# EAGLE design Lipo-Charger-5V-setup (EAGLE 8.2.0)
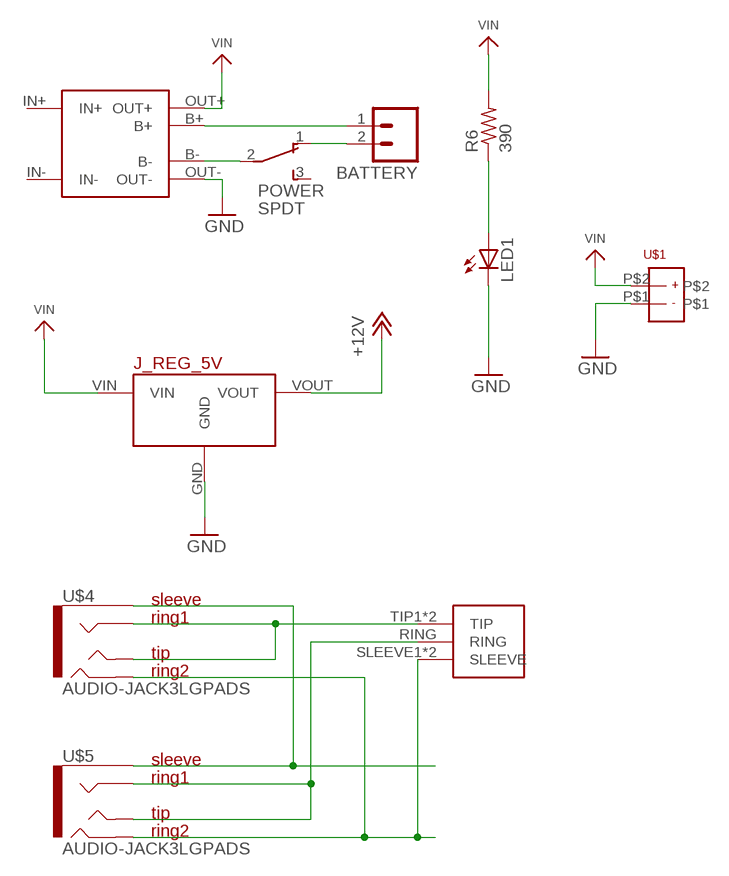
[diagram p0: schematic, sheet 1]

## Parts
AUDIO_OUT  1/8"-F-STEREO-PCB  [1/8"-F-STEREO-PCB]
BATTERY  M02LOCK  [1X02_LOCK]
J_REG_5V  POLOLU_VOLTAGE_REGULATORS_3PIN  [POLOLU_5V-12V_STEPUP_U3V12F5-U3V12F12]
LED1  LED3MM  [LED3MM]
POWER  SPDT  SWITCH_SPDTTE-CONNECT  [SWITCH_SPDT-TE-CONNECT]
R6  390  R-US_0204/7  [0204/7]
U$1  BATTERY-3.7V-1S-LIPOBATTERY_MORPILOT-3.7-1S-720MAH  [BATTERY_MORPILOT-3.7-1S-720MAH]
U$4  AUDIO-JACK3LGPADS  [AUDIO-JACK-TRRS-SMD]
U$5  AUDIO-JACK3LGPADS  [AUDIO-JACK-TRRS-SMD]
USB-LIPO-CHARGER  TP4056-MODULE  [TP4056-LITHIUM-PROTECTED-MODULE]

## Nets
+5V: U$4.EARTH U$5.EARTH
+12V: J_REG_5V.VOUT
GND: J_REG_5V.GND LED1.K(C) U$1.P$1 USB-LIPO-CHARGER.OUT-
GND1: AUDIO_OUT.SLEEVE1(SLEEVE) AUDIO_OUT.SLEEVE2(SLEEVE) U$4.RING2 U$5.RING2
N$1: BATTERY.2 POWER.1
N$2: LED1.A R6.1
N$8: AUDIO_OUT.RING U$5.RING1 U$5.TIP
N$18: BATTERY.1 USB-LIPO-CHARGER.B+
N$19: POWER.2 USB-LIPO-CHARGER.B-
OUT2: AUDIO_OUT.TIP1(TIP) AUDIO_OUT.TIP2(TIP) U$4.RING1 U$4.TIP
VIN: J_REG_5V.VIN R6.2 U$1.P$2 USB-LIPO-CHARGER.OUT+
Unconnected: POWER.3

## Power pins joined to a net without a drawn wire
IN+: USB-LIPO-CHARGER.IN+
IN-: USB-LIPO-CHARGER.IN-

## Library data of the parts
AUDIO_OUT = CMU-ArtFab:1/8"-F-STEREO-PCB
BATTERY = CMU-ArtFab:M02: Header 2 Standard 2-pin 0.1" header. Use with straight break away headers (SKU : PRT-00116), right angle break away headers (PRT-00553), swiss pins (PRT-00743), machine pins (PRT-00117), and female headers (PRT-00115). Molex polarized connector foot print use with SKU : PRT-08233 with associated crimp pins and housings.
J_REG_5V = CMU-ArtFab:POLOLU_VOLTAGE_REGULATORS_3PIN: Polulu 5V Step-Up/Step-Down Voltage REgulator S7V7F5
LED1 = led:LED: LED OSRAM: - CHIPLED LG R971, LG N971, LY N971, LG Q971, LY Q971, LO R971, LY R971 LH N974, LH R974 LS Q976, LO Q976, LY Q976 LO Q996 - Hyper CHIPLED LW Q18S LB Q993, LB Q99A, LB R99A - SideLED LS A670, LO A670, LY A670, LG A670, LP A670 LB A673, LV A673, LT A673, LW A673 LH A674 LY A675 LS A676, LA A676, LO A676, LY A676, LW A676 LS A679, LY A679, LG A679 - Hyper Micro SIDELED® LS Y876, LA Y876, LO Y876, LY Y876 LT Y87S - SmartLED LW L88C, LW L88S LB L89C, LB L89S, LG L890 LS L89K, LO L89K, LY L89K LS L896, LA L896, LO L896, LY L896 - TOPLED LS T670, LO T670, LY T670, LG T670, LP T670 LSG T670, LSP T670, LSY T670, LOP T670, LYG T670 LG T671, LOG T671, LSG T671 LB T673, LV T673, LT T673, LW T673 LH T674 LS T676, LA T676, LO T676, LY T676, LB T676, LH T676, LSB T676, LW T676 LB T67C, LV T67C, LT T67C, LS T67K, LO T67K, LY T67K, LW E67C LS E67B, LA E67B, LO E67B, LY E67B, LB E67C, LV E67C, LT E67C LW T67C LS T679, LY T679, LG T679 LS T770, LO T770, LY T770, LG T770, LP T770 LB T773, LV T773, LT T773, LW T773 LH T774 LS E675, LA E675, LY E675, LS T675 LS T776, LA T776, LO T776, LY T776, LB T776 LHGB T686 LT T68C, LB T68C - Hyper Mini TOPLED® LB M676 - Mini TOPLED Santana® LG M470 LS M47K, LO M47K, LY M47K Source: http://www.osram.convergy.de LUXEON: - LUMILED® LXK2-PW12-R00, LXK2-PW12-S00, LXK2-PW14-U00, LXK2-PW14-V00 LXK2-PM12-R00, LXK2-PM12-S00, LXK2-PM14-U00 LXK2-PE12-Q00, LXK2-PE12-R00, LXK2-PE12-S00, LXK2-PE14-T00, LXK2-PE14-U00 LXK2-PB12-K00, LXK2-PB12-L00, LXK2-PB12-M00, LXK2-PB14-N00, LXK2-PB14-P00, LXK2-PB14-Q00 LXK2-PR12-L00, LXK2-PR12-M00, LXK2-PR14-Q00, LXK2-PR14-R00 LXK2-PD12-Q00, LXK2-PD12-R00, LXK2-PD12-S00 LXK2-PH12-R00, LXK2-PH12-S00 LXK2-PL12-P00, LXK2-PL12-Q00, LXK2-PL12-R00 Source: www.luxeon.com KINGBRIGHT: KA-3528ASYC Source: www.kingbright.com
POWER = CMU-ArtFab:SWITCH_SPDT
R6 = CMU-ArtFab:R-US_: RESISTOR, American symbol
U$1 = CMU-ArtFab:BATTERY-3.7V-1S-LIPO
U$4 U$5 = CMU-ArtFab:AUDIO-JACK3: Audio jack - 3.5mm TRRS variety - two rings.
USB-LIPO-CHARGER = CMU-ArtFab:TP4056-MODULE

## Board
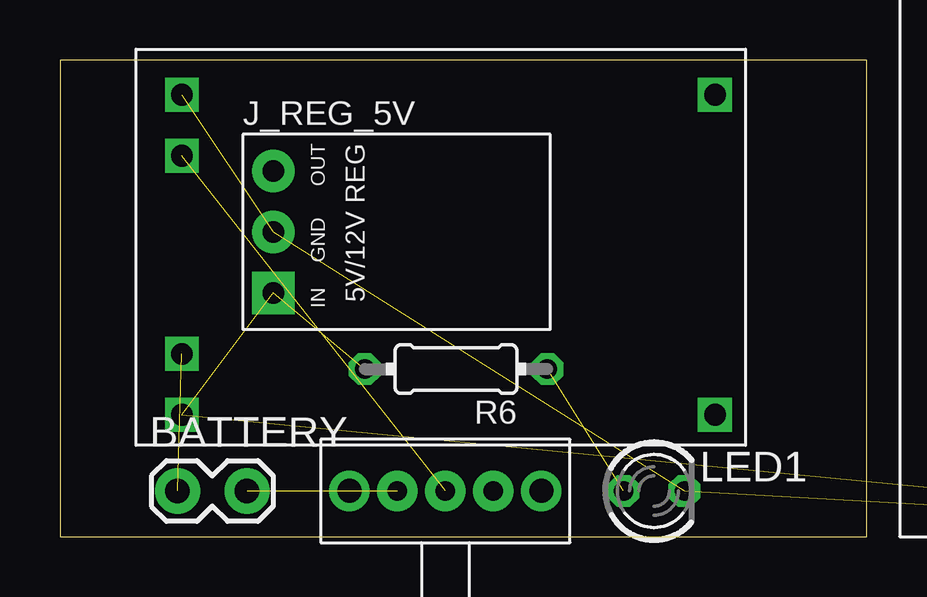
[diagram p1: board, top side]
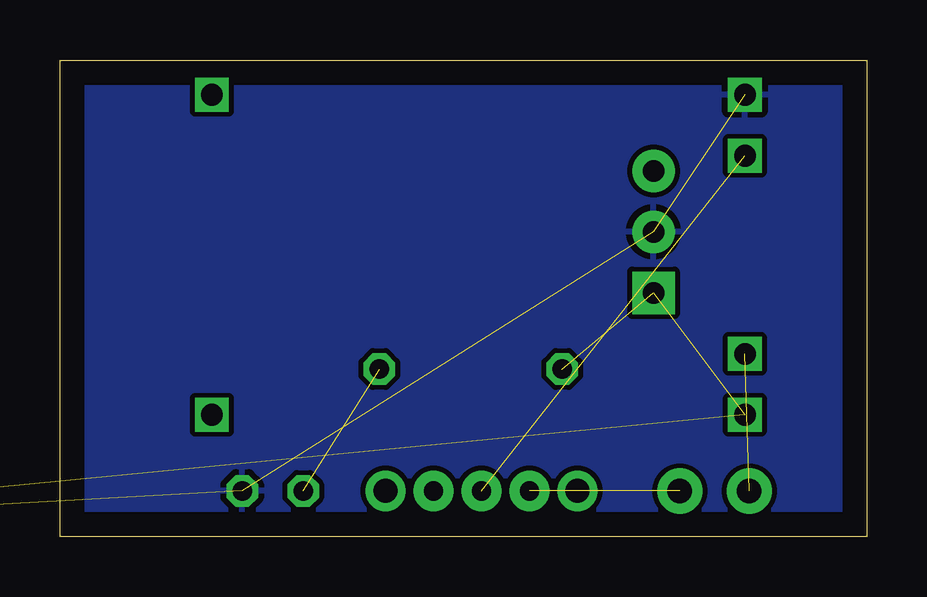
[diagram p2: board, bottom side, seen from below]

Size 33.63 x 19.86 mm. Coordinates in mm from the lower left corner, seen from the top.
Outline: 0,0 33.63,0 33.63,19.86 0,19.86 0,0
Copper layers (1*16): Top 0.035mm / dielectric 1.5mm / Bottom 0.035mm
Design rules "default": minimum track width 10mil, minimum drill 24mil, track to track 8mil, track to pad 8mil, pad to pad 8mil, via to via 8mil, smd to smd 8mil, copper to edge 40mil, drill to drill 8mil, minimum pad ring 10mil, minimum via ring 8mil, stop-mask expansion 4mil, vias tented up to drill 0mil, thermal gap 10mil

### Footprints (pad centres in the part's own frame; a part is rotated, then mirrored left to right if it is on the bottom)
1/8"-F-STEREO-PCB = drill 1.3: RING 5.461,0; SLEEVE1 8.636,6.934; SLEEVE2 8.636,0; TIP1 2.286,6.934; TIP2 2.286,0 | hole 1.4: 2.286,3.556; 7.874,3.556
1X02_LOCK = drill 1.016 pad 1.88: 1 -0.178,0; 2 2.718,0
POLOLU_5V-12V_STEPUP_U3V12F5-U3V12F12 = drill 0.9 pad 1.778: GND 0,-6.35; VOUT -2.54,-6.35 | drill 0.9 pad 1.778 square: VIN 2.54,-6.35
LED3MM = drill 0.813 octagon: A -1.27,0; K 1.27,0
SWITCH_SPDT-TE-CONNECT = drill 0.8 pad 1.676: 1 2,0; 2 4,0; 3 6,0 | drill 1 pad 1.676: MOUNT1 0,0; MOUNT2 8,0
0204/7 = drill 0.813 octagon: 1 -3.81,0; 2 3.81,0
BATTERY_MORPILOT-3.7-1S-720MAH = drill 0.6 square: P$1 0,0; P$2 0,2.54
AUDIO-JACK-TRRS-SMD = smd 1.524 x 3.175: EARTH 11.227,-3.619; RING1 6.2,3.619; RING2 3.2,3.619; TIP 10.2,3.619 | hole 1.2: 1.6,0; 8.6,0
TP4056-LITHIUM-PROTECTED-MODULE = drill 0.9 square: B+ 10.795,4.445; B- 10.795,-3.81; IN+ -11.43,6.985; IN- -11.43,-6.35; OUT+ 10.795,6.985; OUT- 10.795,-6.35

### Placement (x,y rotation side)
AUDIO_OUT  3,-25 0 top  (outside the outline)
BATTERY  5.08,1.91 0 top
J_REG_5V  15.24,12.7 270 top
LED1  24.77,1.91 0 top
POWER  12.06,1.91 0 top
R6  16.51,6.99 180 top
U$1  60,0 90 top  (outside the outline)
U$4  -2,-44 0 top  (outside the outline)
U$5  13,-44 0 top  (outside the outline)
USB-LIPO-CHARGER  15.88,12.06 180 top

### Tracks (layer width: path | path; a pad name or v marks a point on that pad's centre or on a via)
+5V  (1 unrouted)
GND  (3 unrouted)
  pour Bottom: 0,0 0,19.68 33.66,19.68 33.66,0
GND1  (3 unrouted)
N$1  (1 unrouted)
N$2  (1 unrouted)
N$8  (2 unrouted)
N$18  (1 unrouted)
N$19  (1 unrouted)
OUT2  (3 unrouted)
VIN  (3 unrouted)